# EAGLE schematic LEDLightSticks_V2--04--USB_to_Molex_PCB_v15 (EAGLE 9.7.0)
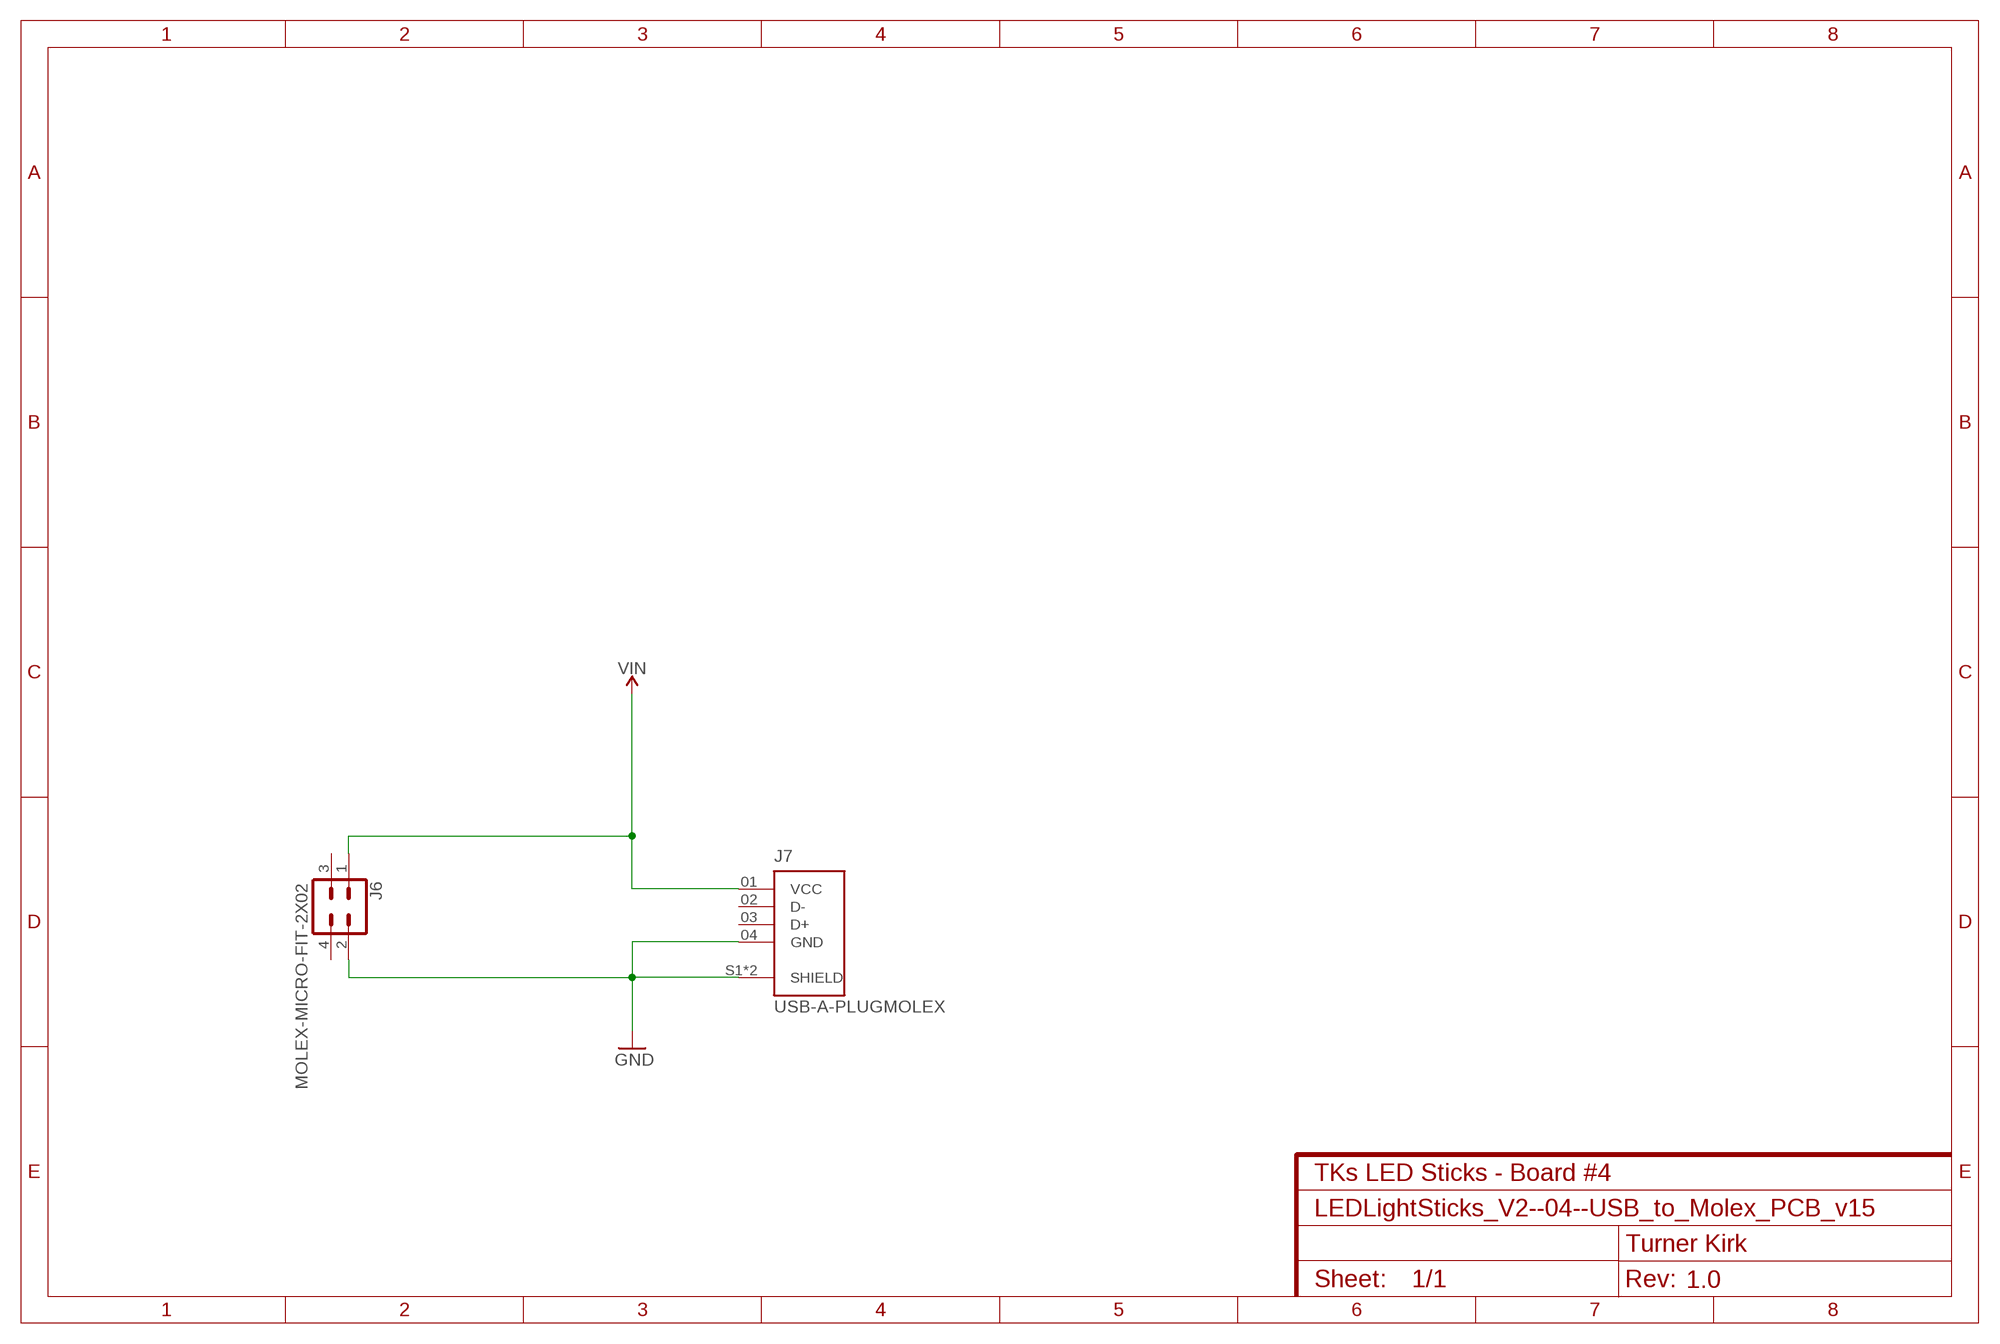
[diagram p0: schematic, sheet 1]
FRAME1 (FRAME-A4L): CNAME: TKs LED Sticks - Board #4; CREVISION: 1.0; DESIGNER: Turner Kirk

## Parts
J6  MOLEX-MICRO-FIT-2X02  [MICROFIT_2X2_RA_FEMALE]
J7  USB-A-PLUGMOLEX  [MOLEX_USB-480370001-TH]

## Nets
GND: J6.2 J7.04(GND) J7.S1(SHIELD) J7.S2(SHIELD)
VIN: J6.1 J7.01(VCC)
Unconnected: J6.3 J6.4 J7.02(D-) J7.03(D+)

## Library data of the parts
J6 = LED_Light_Sticks_Library:MOLEX-MICRO-FIT-2X02
J7 = LED_Light_Sticks_Library:USB-A-PLUG: USB-A (USB TYPE-A) USB 2.0 Plug Connector 4 Position Through Hole, Right Angle